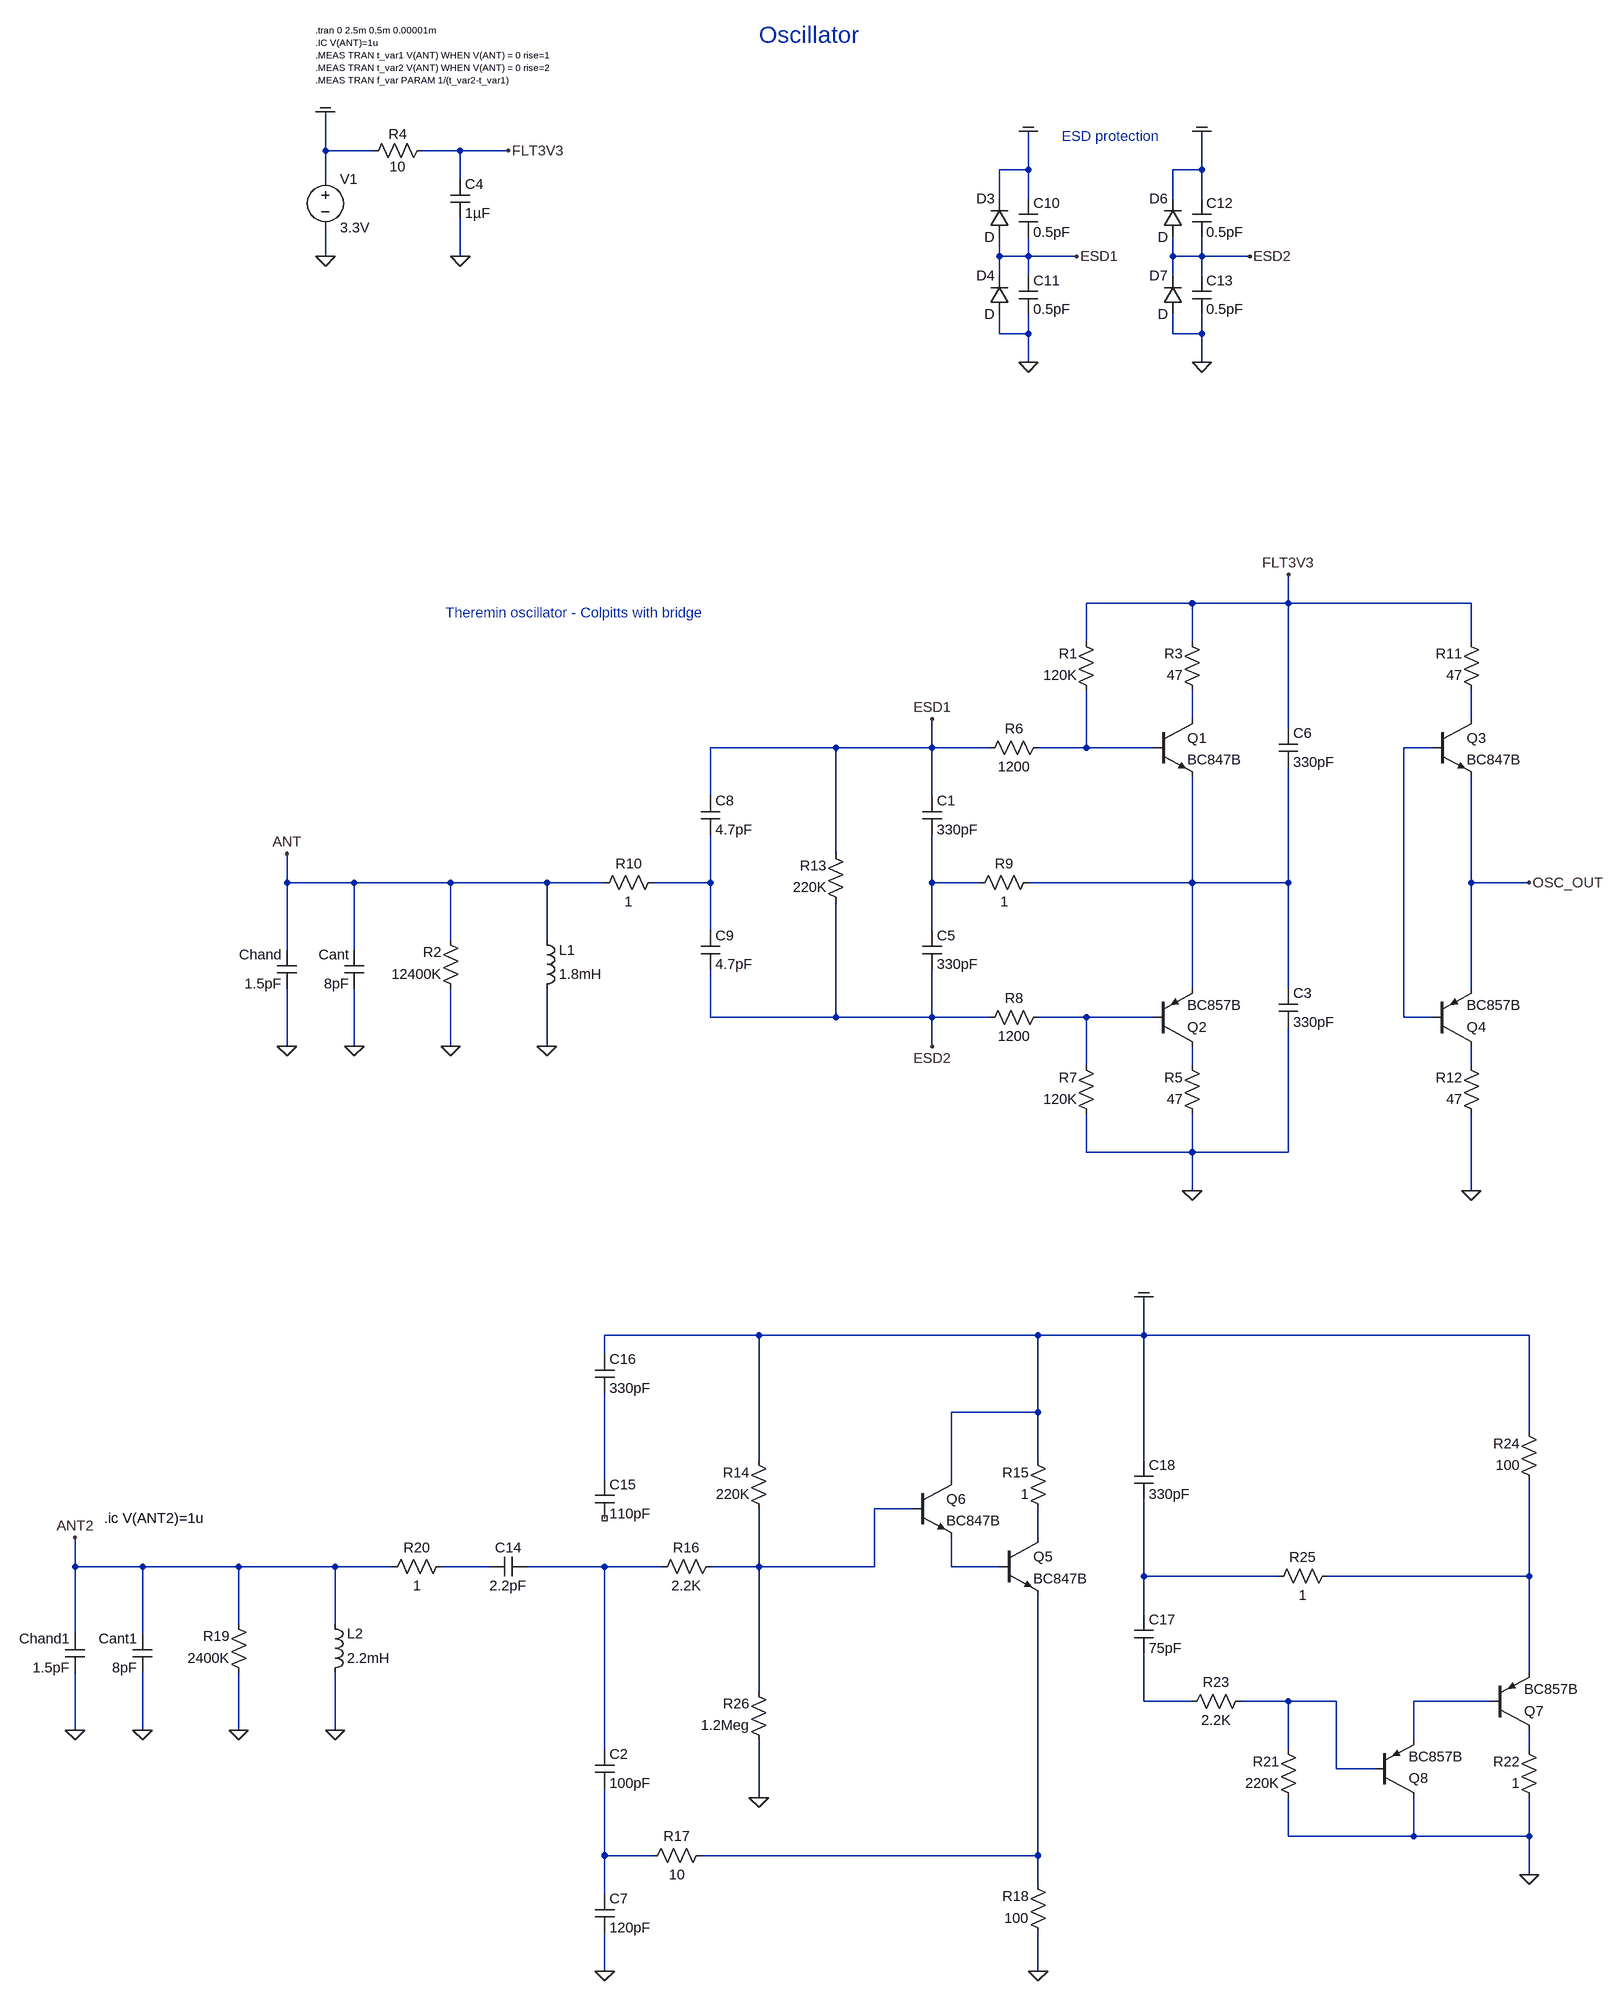
[diagram p0: schematic 2020_npn_pnp_osc_test_v16.asc]
2020_npn_pnp_osc_test_v16.asc, the LTspice schematic file:
Version 4
SHEET 1 2908 2724
WIRE -1056 -336 -1056 -400
WIRE -976 -336 -1056 -336
WIRE -832 -336 -896 -336
WIRE -752 -336 -832 -336
WIRE 112 -304 112 -368
WIRE 112 -304 64 -304
WIRE 400 -304 400 -368
WIRE 400 -304 352 -304
WIRE -1056 -288 -1056 -336
WIRE -832 -288 -832 -336
WIRE 64 -256 64 -304
WIRE 112 -256 112 -304
WIRE 352 -256 352 -304
WIRE 400 -256 400 -304
WIRE -1056 -160 -1056 -208
WIRE -832 -160 -832 -224
WIRE 64 -160 64 -192
WIRE 112 -160 112 -192
WIRE 112 -160 64 -160
WIRE 192 -160 112 -160
WIRE 352 -160 352 -192
WIRE 400 -160 400 -192
WIRE 400 -160 352 -160
WIRE 480 -160 400 -160
WIRE 64 -128 64 -160
WIRE 112 -128 112 -160
WIRE 352 -128 352 -160
WIRE 400 -128 400 -160
WIRE 64 -32 64 -64
WIRE 112 -32 112 -64
WIRE 112 -32 64 -32
WIRE 352 -32 352 -64
WIRE 400 -32 400 -64
WIRE 400 -32 352 -32
WIRE 112 16 112 -32
WIRE 400 16 400 -32
WIRE 384 416 208 416
WIRE 544 416 544 368
WIRE 544 416 384 416
WIRE 848 416 544 416
WIRE 208 480 208 416
WIRE 384 480 384 416
WIRE 848 480 848 416
WIRE 384 608 384 560
WIRE 848 608 848 560
WIRE 544 624 544 416
WIRE -208 656 -416 656
WIRE -48 656 -48 608
WIRE -48 656 -208 656
WIRE 48 656 -48 656
WIRE 208 656 208 560
WIRE 208 656 128 656
WIRE 320 656 208 656
WIRE 784 656 736 656
WIRE -416 736 -416 656
WIRE -48 736 -48 656
WIRE -208 832 -208 656
WIRE -1120 880 -1120 832
WIRE -1008 880 -1120 880
WIRE -848 880 -1008 880
WIRE -688 880 -848 880
WIRE -592 880 -688 880
WIRE -416 880 -416 800
WIRE -416 880 -512 880
WIRE -48 880 -48 800
WIRE 32 880 -48 880
WIRE 384 880 384 704
WIRE 384 880 112 880
WIRE 544 880 544 688
WIRE 544 880 384 880
WIRE 848 880 848 704
WIRE 944 880 848 880
WIRE -416 960 -416 880
WIRE -48 960 -48 880
WIRE -848 976 -848 880
WIRE -688 976 -688 880
WIRE -1120 992 -1120 880
WIRE -1008 992 -1008 880
WIRE 384 1056 384 880
WIRE 544 1056 544 880
WIRE 848 1056 848 880
WIRE -416 1104 -416 1024
WIRE -208 1104 -208 912
WIRE -208 1104 -416 1104
WIRE -48 1104 -48 1024
WIRE -48 1104 -208 1104
WIRE 48 1104 -48 1104
WIRE 208 1104 128 1104
WIRE 320 1104 208 1104
WIRE 736 1104 736 656
WIRE 784 1104 736 1104
WIRE -1120 1152 -1120 1056
WIRE -1008 1152 -1008 1056
WIRE -848 1152 -848 1056
WIRE -688 1152 -688 1056
WIRE -48 1152 -48 1104
WIRE 208 1184 208 1104
WIRE 384 1184 384 1152
WIRE 848 1184 848 1152
WIRE 208 1328 208 1264
WIRE 384 1328 384 1264
WIRE 384 1328 208 1328
WIRE 544 1328 544 1120
WIRE 544 1328 384 1328
WIRE 384 1392 384 1328
WIRE 848 1392 848 1264
WIRE -336 1632 -592 1632
WIRE 128 1632 -336 1632
WIRE 304 1632 304 1568
WIRE 304 1632 128 1632
WIRE 944 1632 304 1632
WIRE -592 1664 -592 1632
WIRE 128 1760 128 1632
WIRE 128 1760 -16 1760
WIRE 944 1792 944 1632
WIRE -336 1840 -336 1632
WIRE 128 1840 128 1760
WIRE 304 1840 304 1632
WIRE -592 1872 -592 1728
WIRE -16 1872 -16 1760
WIRE -80 1920 -144 1920
WIRE 128 1968 128 1920
WIRE -1472 2016 -1472 1968
WIRE -1360 2016 -1472 2016
WIRE -1200 2016 -1360 2016
WIRE -1040 2016 -1200 2016
WIRE -944 2016 -1040 2016
WIRE -784 2016 -864 2016
WIRE -592 2016 -720 2016
WIRE -496 2016 -592 2016
WIRE -336 2016 -336 1920
WIRE -336 2016 -416 2016
WIRE -144 2016 -144 1920
WIRE -144 2016 -336 2016
WIRE -16 2016 -16 1968
WIRE 64 2016 -16 2016
WIRE 304 2032 304 1904
WIRE 528 2032 304 2032
WIRE 944 2032 944 1872
WIRE 944 2032 608 2032
WIRE 304 2096 304 2032
WIRE -1200 2112 -1200 2016
WIRE -1040 2112 -1040 2016
WIRE -1472 2128 -1472 2016
WIRE -1360 2128 -1360 2016
WIRE 944 2192 944 2032
WIRE -336 2224 -336 2016
WIRE 304 2240 304 2160
WIRE 384 2240 304 2240
WIRE 544 2240 464 2240
WIRE 624 2240 544 2240
WIRE 880 2240 752 2240
WIRE -1472 2288 -1472 2192
WIRE -1360 2288 -1360 2192
WIRE -1200 2288 -1200 2192
WIRE -1040 2288 -1040 2192
WIRE 752 2304 752 2240
WIRE -592 2320 -592 2016
WIRE 544 2320 544 2240
WIRE 944 2320 944 2288
WIRE 624 2352 624 2240
WIRE 688 2352 624 2352
WIRE -336 2400 -336 2304
WIRE 544 2464 544 2400
WIRE 752 2464 752 2400
WIRE 752 2464 544 2464
WIRE 944 2464 944 2400
WIRE 944 2464 752 2464
WIRE -592 2496 -592 2384
WIRE -512 2496 -592 2496
WIRE 128 2496 128 2064
WIRE 128 2496 -432 2496
WIRE 944 2528 944 2464
WIRE 128 2544 128 2496
WIRE -592 2560 -592 2496
WIRE -592 2688 -592 2624
WIRE 128 2688 128 2624
FLAG -1056 -160 0
FLAG -1120 1152 0
FLAG -1120 832 ANT
FLAG -1056 -400 COM
FLAG 112 16 0
FLAG 112 -368 COM
FLAG 192 -160 ESD1
FLAG 400 16 0
FLAG 400 -368 COM
FLAG 480 -160 ESD2
FLAG -1008 1152 0
FLAG -48 608 ESD1
FLAG -832 -160 0
FLAG -848 1152 0
FLAG -688 1152 0
FLAG -752 -336 FLT3V3
FLAG 544 368 FLT3V3
FLAG 944 880 OSC_OUT
FLAG -48 1152 ESD2
FLAG 384 1392 0
FLAG 848 1392 0
FLAG 128 2688 0
FLAG -592 2688 0
FLAG -1472 2288 0
FLAG -1472 1968 ANT2
FLAG -1360 2288 0
FLAG -1200 2288 0
FLAG -1040 2288 0
FLAG 944 2528 0
FLAG 304 1568 COM
FLAG -336 2400 0
SYMBOL voltage -1056 -304 R0
WINDOW 123 0 0 Left 2
WINDOW 39 0 0 Left 2
SYMATTR InstName V1
SYMATTR Value 3.3V
SYMBOL ind -704 1072 M180
WINDOW 0 36 80 Left 2
WINDOW 3 36 40 Left 2
SYMATTR InstName L1
SYMATTR Value 1.8mH
SYMATTR SpiceLine Ipk=0.1 Rser=82 Rpar=20Meg Cpar=1.286pF
SYMBOL cap -1104 992 M0
SYMATTR InstName Chand
SYMATTR Value 1.5pF
SYMBOL diode 80 -192 R180
WINDOW 0 24 64 Left 2
WINDOW 3 24 0 Left 2
SYMATTR InstName D3
SYMBOL diode 80 -64 R180
WINDOW 0 24 64 Left 2
WINDOW 3 24 0 Left 2
SYMATTR InstName D4
SYMBOL cap 96 -256 R0
SYMATTR InstName C10
SYMATTR Value 0.5pF
SYMBOL cap 96 -128 R0
SYMATTR InstName C11
SYMATTR Value 0.5pF
SYMBOL diode 368 -192 R180
WINDOW 0 24 64 Left 2
WINDOW 3 24 0 Left 2
SYMATTR InstName D6
SYMBOL diode 368 -64 R180
WINDOW 0 24 64 Left 2
WINDOW 3 24 0 Left 2
SYMATTR InstName D7
SYMBOL cap 384 -256 R0
SYMATTR InstName C12
SYMATTR Value 0.5pF
SYMBOL cap 384 -128 R0
SYMATTR InstName C13
SYMATTR Value 0.5pF
SYMBOL cap -992 992 M0
SYMATTR InstName Cant
SYMATTR Value 8pF
SYMBOL res -880 -352 R90
WINDOW 0 5 56 VBottom 2
WINDOW 3 27 56 VTop 2
SYMATTR InstName R4
SYMATTR Value 10
SYMBOL cap -848 -288 R0
SYMATTR InstName C4
SYMATTR Value 1µF
SYMBOL res 224 576 R180
WINDOW 0 31 76 Left 2
WINDOW 3 31 40 Left 2
SYMATTR InstName R1
SYMATTR Value 120K
SYMBOL res -832 1072 R180
WINDOW 0 31 76 Left 2
WINDOW 3 31 40 Left 2
SYMATTR InstName R2
SYMATTR Value 12400K
SYMBOL cap -64 736 R0
SYMATTR InstName C1
SYMATTR Value 330pF
SYMBOL cap 528 1056 R0
SYMATTR InstName C3
SYMATTR Value 330pF
SYMBOL npn 320 608 R0
SYMATTR InstName Q1
SYMATTR Value BC847B
SYMBOL pnp 320 1152 M180
SYMATTR InstName Q2
SYMATTR Value BC857B
SYMBOL res 224 1280 R180
WINDOW 0 31 76 Left 2
WINDOW 3 31 40 Left 2
SYMATTR InstName R7
SYMATTR Value 120K
SYMBOL cap -64 960 R0
SYMATTR InstName C5
SYMATTR Value 330pF
SYMBOL cap 528 624 R0
SYMATTR InstName C6
SYMATTR Value 330pF
SYMBOL cap -432 736 R0
SYMATTR InstName C8
SYMATTR Value 4.7pF
SYMBOL cap -432 960 R0
SYMATTR InstName C9
SYMATTR Value 4.7pF
SYMBOL res 400 576 R180
WINDOW 0 31 76 Left 2
WINDOW 3 31 40 Left 2
SYMATTR InstName R3
SYMATTR Value 47
SYMBOL res 400 1280 R180
WINDOW 0 31 76 Left 2
WINDOW 3 31 40 Left 2
SYMATTR InstName R5
SYMATTR Value 47
SYMBOL res 32 672 R270
WINDOW 0 32 56 VTop 2
WINDOW 3 0 56 VBottom 2
SYMATTR InstName R6
SYMATTR Value 1200
SYMBOL res 32 1120 R270
WINDOW 0 32 56 VTop 2
WINDOW 3 0 56 VBottom 2
SYMATTR InstName R8
SYMATTR Value 1200
SYMBOL res 16 896 R270
WINDOW 0 32 56 VTop 2
WINDOW 3 0 56 VBottom 2
SYMATTR InstName R9
SYMATTR Value 1
SYMBOL res -608 896 R270
WINDOW 0 32 56 VTop 2
WINDOW 3 0 56 VBottom 2
SYMATTR InstName R10
SYMATTR Value 1
SYMBOL npn 784 608 R0
SYMATTR InstName Q3
SYMATTR Value BC847B
SYMBOL pnp 784 1152 M180
SYMATTR InstName Q4
SYMATTR Value BC857B
SYMBOL res 864 576 R180
WINDOW 0 31 76 Left 2
WINDOW 3 31 40 Left 2
SYMATTR InstName R11
SYMATTR Value 47
SYMBOL res 864 1280 R180
WINDOW 0 31 76 Left 2
WINDOW 3 31 40 Left 2
SYMATTR InstName R12
SYMATTR Value 47
SYMBOL res -192 928 R180
WINDOW 0 31 76 Left 2
WINDOW 3 31 40 Left 2
SYMATTR InstName R13
SYMATTR Value 220K
SYMBOL res -320 1936 R180
WINDOW 0 31 76 Left 2
WINDOW 3 31 40 Left 2
SYMATTR InstName R14
SYMATTR Value 220K
SYMBOL cap -608 2320 R0
SYMATTR InstName C2
SYMATTR Value 100pF
SYMBOL npn 64 1968 R0
SYMATTR InstName Q5
SYMATTR Value BC847B
SYMBOL res 144 1936 R180
WINDOW 0 31 76 Left 2
WINDOW 3 31 40 Left 2
SYMATTR InstName R15
SYMATTR Value 1
SYMBOL res -512 2032 R270
WINDOW 0 32 56 VTop 2
WINDOW 3 0 56 VBottom 2
SYMATTR InstName R16
SYMATTR Value 2.2K
SYMBOL res -528 2512 R270
WINDOW 0 32 56 VTop 2
WINDOW 3 0 56 VBottom 2
SYMATTR InstName R17
SYMATTR Value 10
SYMBOL cap -608 2560 R0
SYMATTR InstName C7
SYMATTR Value 120pF
SYMBOL res 144 2640 R180
WINDOW 0 31 76 Left 2
WINDOW 3 31 40 Left 2
SYMATTR InstName R18
SYMATTR Value 100
SYMBOL cap -720 2000 R90
WINDOW 0 0 32 VBottom 2
WINDOW 3 32 32 VTop 2
SYMATTR InstName C14
SYMATTR Value 2.2pF
SYMBOL ind -1056 2208 M180
WINDOW 0 36 80 Left 2
WINDOW 3 36 40 Left 2
SYMATTR InstName L2
SYMATTR Value 2.2mH
SYMATTR SpiceLine Ipk=0.1 Rser=82 Rpar=20Meg Cpar=1.286pF
SYMBOL cap -1456 2128 M0
SYMATTR InstName Chand1
SYMATTR Value 1.5pF
SYMBOL cap -1344 2128 M0
SYMATTR InstName Cant1
SYMATTR Value 8pF
SYMBOL res -1184 2208 R180
WINDOW 0 31 76 Left 2
WINDOW 3 31 40 Left 2
SYMATTR InstName R19
SYMATTR Value 2400K
SYMBOL res -960 2032 R270
WINDOW 0 32 56 VTop 2
WINDOW 3 0 56 VBottom 2
SYMATTR InstName R20
SYMATTR Value 1
SYMBOL npn -80 1872 R0
SYMATTR InstName Q6
SYMATTR Value BC847B
SYMBOL cap -608 1872 R0
SYMATTR InstName C15
SYMATTR Value 110pF
SYMBOL cap -608 1664 R0
SYMATTR InstName C16
SYMATTR Value 330pF
SYMBOL pnp 880 2288 M180
SYMATTR InstName Q7
SYMATTR Value BC857B
SYMBOL res 560 2416 R180
WINDOW 0 31 76 Left 2
WINDOW 3 31 40 Left 2
SYMATTR InstName R21
SYMATTR Value 220K
SYMBOL res 960 2416 R180
WINDOW 0 31 76 Left 2
WINDOW 3 31 40 Left 2
SYMATTR InstName R22
SYMATTR Value 1
SYMBOL res 368 2256 R270
WINDOW 0 32 56 VTop 2
WINDOW 3 0 56 VBottom 2
SYMATTR InstName R23
SYMATTR Value 2.2K
SYMBOL pnp 688 2400 M180
SYMATTR InstName Q8
SYMATTR Value BC857B
SYMBOL res 960 1888 R180
WINDOW 0 31 76 Left 2
WINDOW 3 31 40 Left 2
SYMATTR InstName R24
SYMATTR Value 100
SYMBOL res 512 2048 R270
WINDOW 0 32 56 VTop 2
WINDOW 3 0 56 VBottom 2
SYMATTR InstName R25
SYMATTR Value 1
SYMBOL cap 288 2096 R0
SYMATTR InstName C17
SYMATTR Value 75pF
SYMBOL cap 288 1840 R0
SYMATTR InstName C18
SYMATTR Value 330pF
SYMBOL res -320 2320 R180
WINDOW 0 31 76 Left 2
WINDOW 3 31 40 Left 2
SYMATTR InstName R26
SYMATTR Value 1.2Meg
TEXT -1072 -536 Left 1 !.tran 0 2.5m 0.5m 0.00001m\n.IC V(ANT)=1u\n.MEAS TRAN t_var1 V(ANT) WHEN V(ANT) = 0 rise=1\n.MEAS TRAN t_var2 V(ANT) WHEN V(ANT) = 0 rise=2\n.MEAS TRAN f_var PARAM 1/(t_var2-t_var1)
TEXT 168 -360 Left 2 ;ESD protection
TEXT -336 -528 Left 4 ;Oscillator
TEXT -856 432 Left 2 ;Theremin oscillator - Colpitts with bridge
TEXT -1424 1936 Left 2 !.ic V(ANT2)=1u

The netlist it stands for:
* 2020_npn_pnp_osc_test_v16.asc
V1 COM 0 3.3V
L1 0 ANT 1.8mH Ipk=0.1 Rser=82 Rpar=20Meg Cpar=1.286pF
Chand ANT 0 1.5pF
D3 ESD1 COM D
D4 0 ESD1 D
C10 COM ESD1 0.5pF
C11 ESD1 0 0.5pF
D6 ESD2 COM D
D7 0 ESD2 D
C12 COM ESD2 0.5pF
C13 ESD2 0 0.5pF
Cant ANT 0 8pF
R4 FLT3V3 COM 10
C4 FLT3V3 0 1µF
R1 N003 FLT3V3 120K
R2 0 ANT 12400K
C1 ESD1 N006 330pF
C3 N007 0 330pF
Q1 N001 N003 N007 0 BC847B
Q2 N009 N008 N007 0 BC857B
R7 0 N008 120K
C5 N006 ESD2 330pF
C6 FLT3V3 N007 330pF
C8 ESD1 N005 4.7pF
C9 N005 ESD2 4.7pF
R3 N001 FLT3V3 47
R5 0 N009 47
R6 ESD1 N003 1200
R8 ESD2 N008 1200
R9 N006 N007 1
R10 ANT N005 1
Q3 N002 N004 OSC_OUT 0 BC847B
Q4 N010 N004 OSC_OUT 0 BC857B
R11 N002 FLT3V3 47
R12 0 N010 47
R13 ESD2 ESD1 220K
R14 N012 COM 220K
C2 N015 N023 100pF
Q5 N013 N016 N024 0 BC847B
R15 N013 COM 1
R16 N015 N012 2.2K
R17 N023 N024 10
C7 N023 0 120pF
R18 0 N024 100
C14 N015 N014 2.2pF
L2 0 ANT2 2.2mH Ipk=0.1 Rser=82 Rpar=20Meg Cpar=1.286pF
Chand1 ANT2 0 1.5pF
Cant1 ANT2 0 8pF
R19 0 ANT2 2400K
R20 ANT2 N014 1
Q6 COM N012 N016 0 BC847B
C15 N011 NC_01 110pF
C16 COM N011 330pF
Q7 N022 N021 N018 0 BC857B
R21 0 N020 220K
R22 0 N022 1
R23 N019 N020 2.2K
Q8 0 N020 N021 0 BC857B
R24 N018 COM 100
R25 N017 N018 1
C17 N017 N019 75pF
C18 COM N017 330pF
R26 0 N012 1.2Meg
.model D D
.lib standard.dio
.model NPN NPN
.model PNP PNP
.lib standard.bjt
.tran 0 2.5m 0.5m 0.00001m
.IC V(ANT)=1u
.MEAS TRAN t_var1 V(ANT) WHEN V(ANT) = 0 rise=1
.MEAS TRAN t_var2 V(ANT) WHEN V(ANT) = 0 rise=2
.MEAS TRAN f_var PARAM 1/(t_var2-t_var1)
* ESD protection
* Oscillator
* Theremin oscillator - Colpitts with bridge
.ic V(ANT2)=1u
.backanno
.end